# EAGLE design simpluino (EAGLE 5.11)
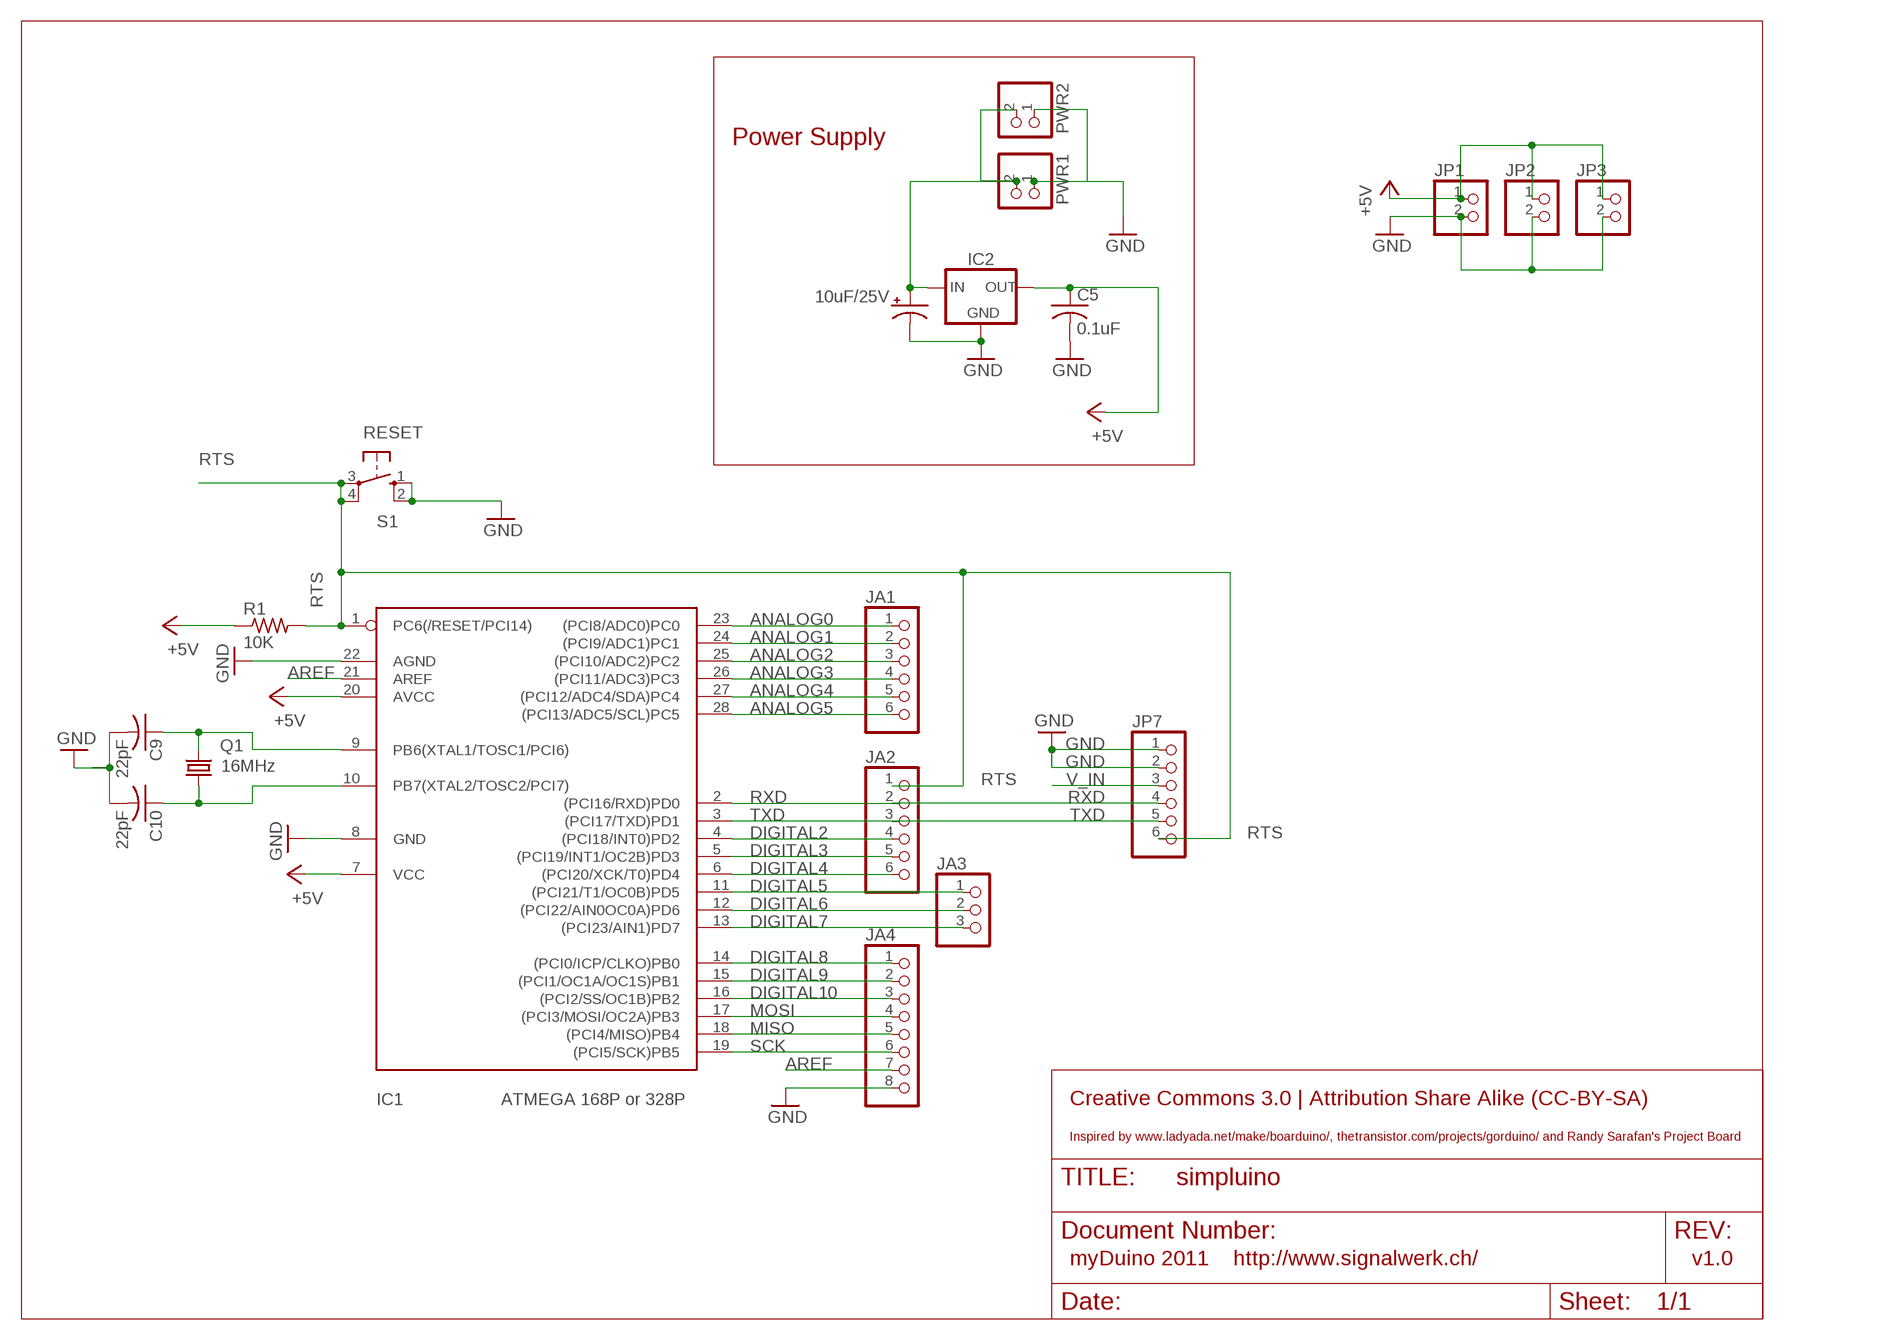
[diagram p0: schematic, sheet 1]

## Parts
C3  10uF/25V  CPOL-USE2.5-6  [E2,5-6]
C5  0.1uF  C-US025-025X050  [C025-025X050]
C9  22pF  C-US025-024X044  [C025-024X044]
C10  22pF  C-US025-024X044  [C025-024X044]
IC1  ATMEGA 168P or 328P  ATMEGA168PROUND  [DIL28/3]
IC2  78XXS  [78XXS]
JA1  PINHD-1X6CB  [1X06-CLEANBIG]
JA2  PINHD-1X6CB  [1X06-CLEANBIG]
JA3  PINHD-1X3CB  [1X03-CB]
JA4  PINHD-1X8CLEANBIG  [1X08-CLEANBIG]
JP1  PINHD-1X2CB  [1X02-CB]
JP2  PINHD-1X2CB  [1X02-CB]
JP3  PINHD-1X2CB  [1X02-CB]
JP7  PINHD-1X6CLEAN  [1X06-CLEAN]
PWR1  PINHD-1X2CB  [1X02-CB]
PWR2  PINHD-1X2CB  [1X02-CB]
Q1  16MHz  CRYTALHC49S  [HC49/S]
R1  10K  R-US_0207/5V  [0207/5V]
S1  RESET  10-XX  [B3F-10XX]

## Nets
+5V: C5.1 IC1.7(VCC) IC1.20(AVCC) IC2.OUT JP1.1 JP2.1 JP3.1 R1.1
ANALOG0: IC1.23((PCI8/ADC0)PC0) JA1.1
ANALOG1: IC1.24((PCI9/ADC1)PC1) JA1.2
ANALOG2: IC1.25((PCI10/ADC2)PC2) JA1.3
ANALOG3: IC1.26((PCI11/ADC3)PC3) JA1.4
ANALOG4: IC1.27((PCI12/ADC4/SDA)PC4) JA1.5
ANALOG5: IC1.28((PCI13/ADC5/SCL)PC5) JA1.6
AREF: IC1.21(AREF) JA4.7
DIGITAL2: IC1.4((PCI18/INT0)PD2) JA2.4
DIGITAL3: IC1.5((PCI19/INT1/OC2B)PD3) JA2.5
DIGITAL4: IC1.6((PCI20/XCK/T0)PD4) JA2.6
DIGITAL5: IC1.11((PCI21/T1/OC0B)PD5) JA3.1
DIGITAL6: IC1.12((PCI22/AIN0OC0A)PD6) JA3.2
DIGITAL7: IC1.13((PCI23/AIN1)PD7) JA3.3
DIGITAL8: IC1.14((PCI0/ICP/CLKO)PB0) JA4.1
DIGITAL9: IC1.15((PCI1/OC1A/OC1S)PB1) JA4.2
DIGITAL10: IC1.16((PCI2/SS/OC1B)PB2) JA4.3
GND: C3.- C5.2 C9.2 C10.2 IC1.8(GND) IC1.22(AGND) IC2.GND JA4.8 JP1.2 JP2.2 JP3.2 JP7.1 JP7.2 PWR1.1 PWR2.1 S1.1(S) S1.2(S1)
MISO: IC1.18((PCI4/MISO)PB4) JA4.5
MOSI: IC1.17((PCI3/MOSI/OC2A)PB3) JA4.4
N$6: C10.1 IC1.10(PB7(XTAL2/TOSC2/PCI7)) Q1.1
N$7: C9.1 IC1.9(PB6(XTAL1/TOSC1/PCI6)) Q1.2
RTS: IC1.1(PC6(/RESET/PCI14)) JA2.1 JP7.6 R1.2 S1.3(P) S1.4(P1)
RXD: IC1.2((PCI16/RXD)PD0) JA2.2 JP7.4
SCK: IC1.19((PCI5/SCK)PB5) JA4.6
TXD: IC1.3((PCI17/TXD)PD1) JA2.3 JP7.5
V_IN: C3.+ IC2.IN JP7.3 PWR1.2 PWR2.2

## Notes on the sheet
- Power Supply
- Creative Commons 3.0 | Attribution Share Alike (CC-BY-SA)
- Inspired by www.ladyada.net/make/boarduino/, thetransistor.com/projects/gorduino/ and Randy Sarafan's Project Board
- myDuino 2011    http://www.signalwerk.ch/ | v1.0

## Library data of the parts
C3 = minimidi:CPOL-US: POLARIZED CAPACITOR, American symbol
C5 = minimidi:C-US: CAPACITOR, American symbol
C9 C10 = resistor:C-US: CAPACITOR, American symbol
IC1 = avr:ATMEGA168*P: MICROCONTROLLER 16 kBytes FLASH 1 kBytes SRAM 512 Bytes EEPROM USART 8-channel 10 bit ADC
IC2 = v-reg:78XXS: VOLTAGE REGULATOR
JA1 JA2 JP7 = carduino:PINHD-1X6: PIN HEADER
JA3 = carduino_sh:PINHD-1X3: PIN HEADER
JA4 = carduino:PINHD-1X8: PIN HEADER
JP1-JP3 PWR1 PWR2 = carduino:PINHD-1X2: PIN HEADER
Q1 = crystal:CRYTAL: CRYSTAL
R1 = rcl-ez:R-US_: RESISTOR, American symbol
S1 = switch-omron:10-XX: OMRON SWITCH

## Net classes
1 power: width 0.61 mm

## Board
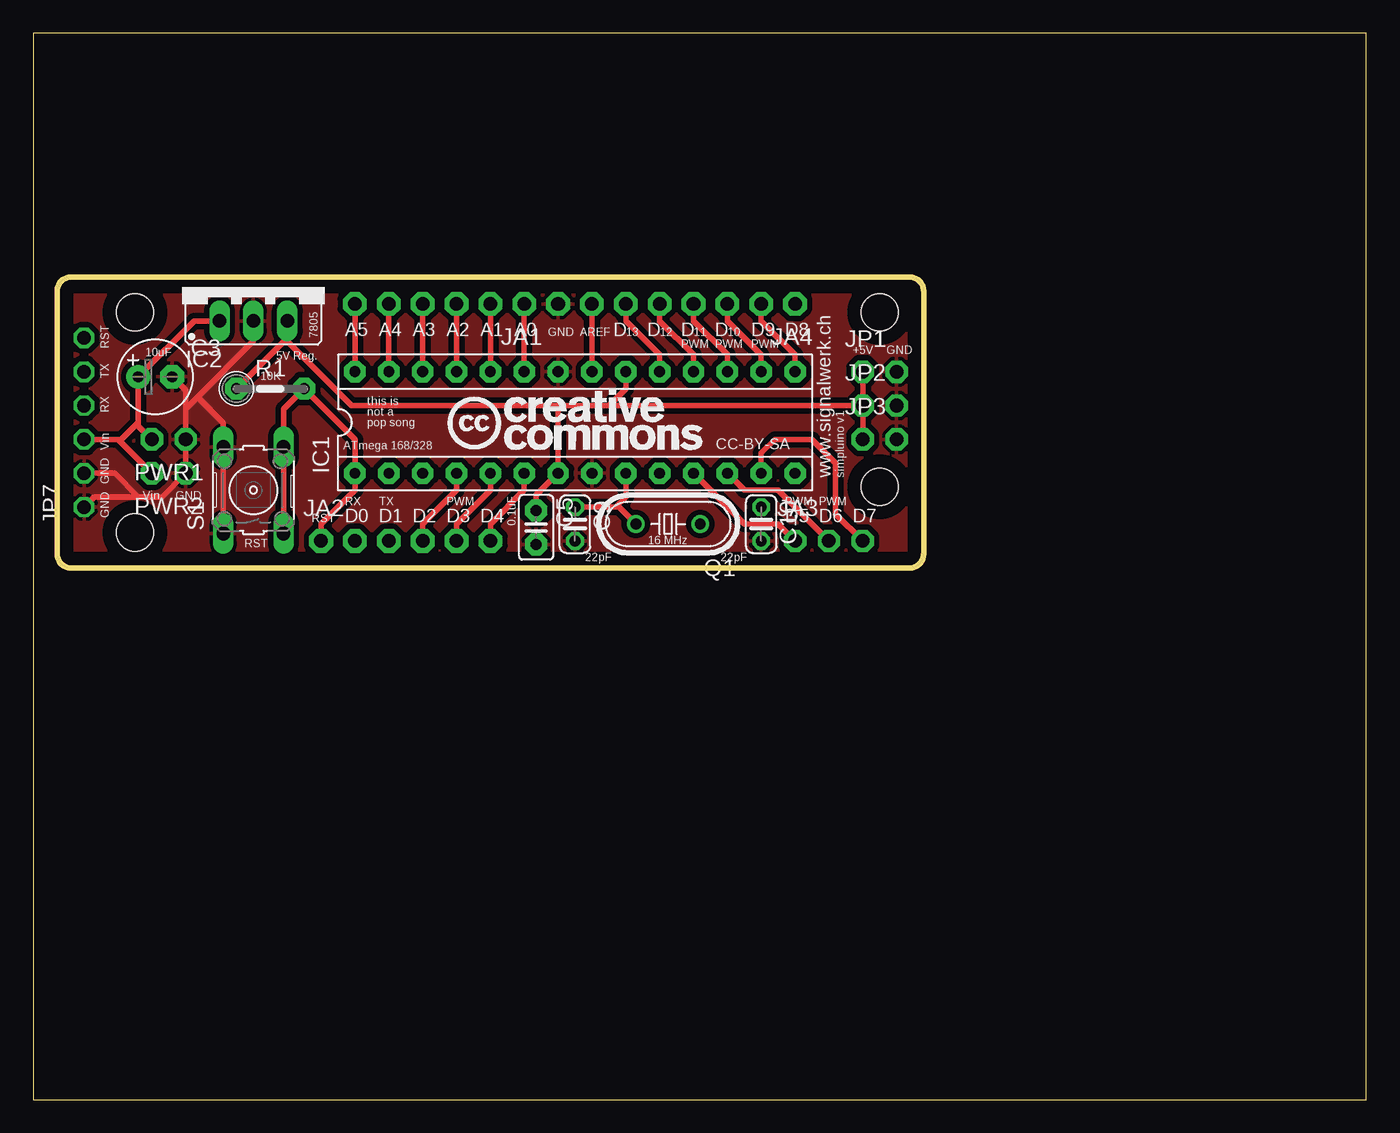
[diagram p1: board, top side]
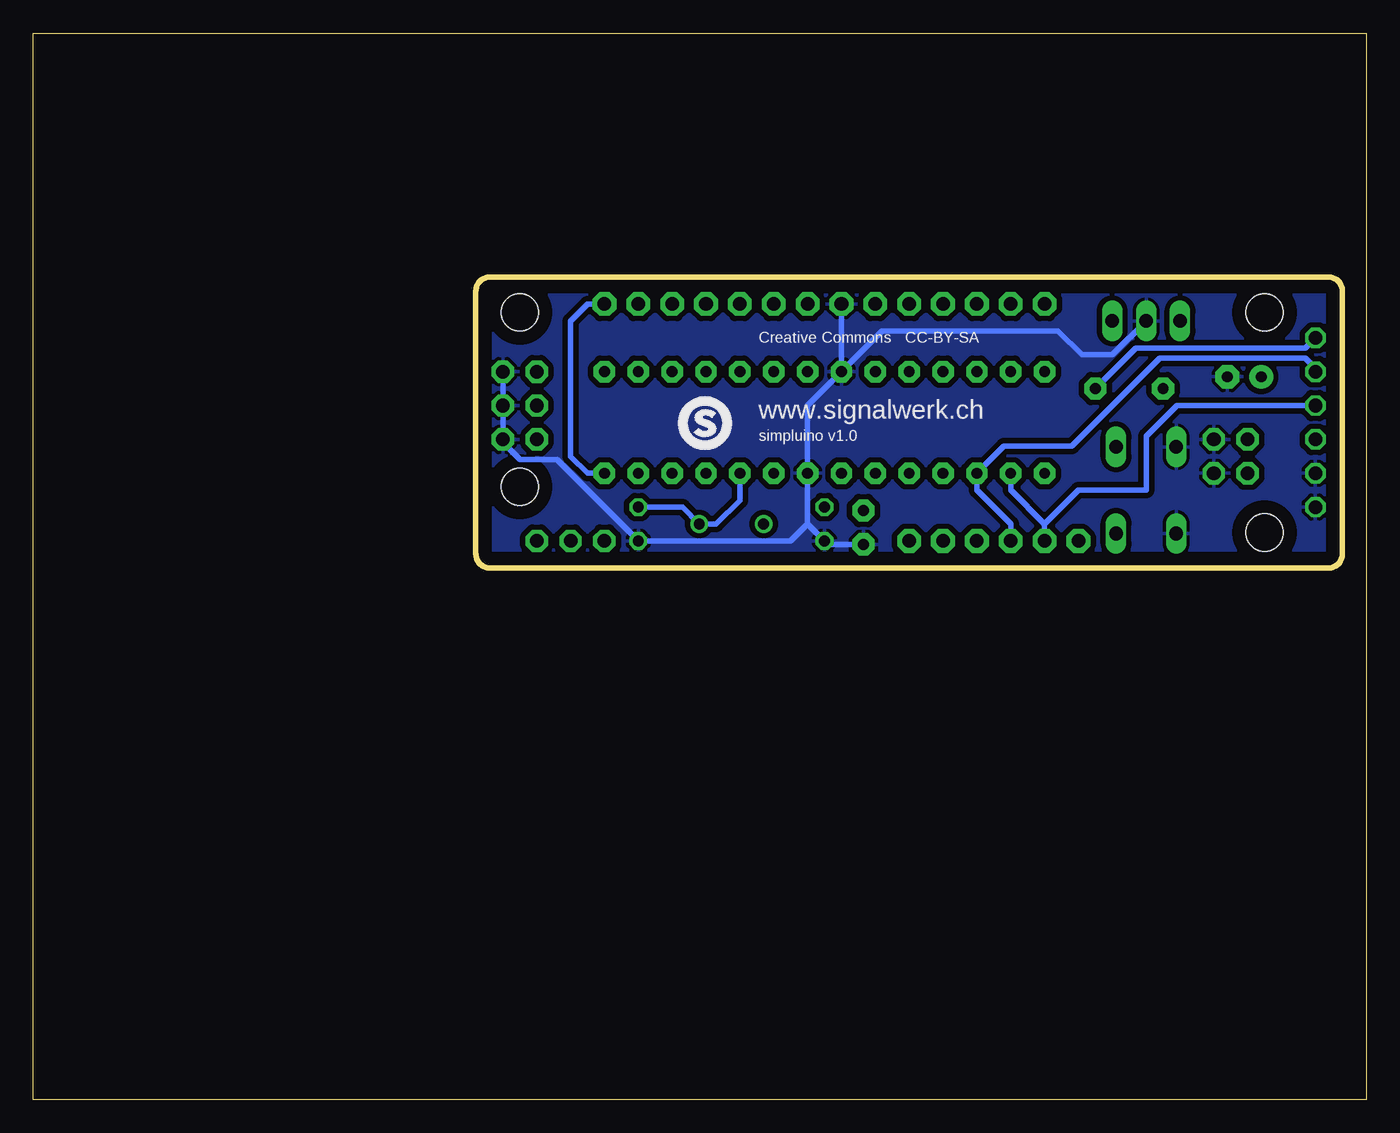
[diagram p2: board, bottom side, seen from below]

Size 100 x 80 mm. Coordinates in mm from the lower left corner, seen from the top.
Outline: 0,0 100,0 100,80 0,80 0,0
Outline: 2.86,61.72 arc90 1.78,60.64 1.78,40.96 arc90 2.86,39.88 65.72,39.88 arc90 66.8,40.96 66.8,60.64 arc90 65.72,61.72 2.86,61.72
Copper layers (1*16): Top 0.035mm / dielectric 1.5mm / Bottom 0.035mm
Design rules "default": minimum track width 10mil, minimum drill 24mil, track to track 8mil, track to pad 8mil, pad to pad 8mil, via to via 8mil, smd to smd 8mil, copper to edge 40mil, drill to drill 8mil, minimum pad ring 10mil, minimum via ring 8mil, stop-mask expansion 4mil, vias tented up to drill 0mil, thermal gap 10mil
Holes 2.8 mm at 7.62,59.05 63.5,45.97 7.62,42.55 63.5,59.05

### Footprints (pad centres in the part's own frame; a part is rotated, then mirrored left to right if it is on the bottom)
E2,5-6 = drill 0.813 pad 1.778 round: + -1.27,0 | drill 0.813 pad 1.778 octagon: - 1.27,0
C025-025X050 = drill 0.813 pad 1.676 octagon: 1 -1.27,0; 2 1.27,0
C025-024X044 = drill 0.813 octagon: 1 -1.27,0; 2 1.27,0
DIL28/3 = drill 0.813 pad 1.6 octagon: 1 -16.51,-3.81; 2 -13.97,-3.81; 3 -11.43,-3.81; 4 -8.89,-3.81; 5 -6.35,-3.81; 6 -3.81,-3.81; 7 -1.27,-3.81; 8 1.27,-3.81; 9 3.81,-3.81; 10 6.35,-3.81; 11 8.89,-3.81; 12 11.43,-3.81; 13 13.97,-3.81; 14 16.51,-3.81; 15 16.51,3.81; 16 13.97,3.81; 17 11.43,3.81; 18 8.89,3.81; 19 6.35,3.81; 20 3.81,3.81; 21 1.27,3.81; 22 -1.27,3.81; 23 -3.81,3.81; 24 -6.35,3.81; 25 -8.89,3.81; 26 -11.43,3.81; 27 -13.97,3.81; 28 -16.51,3.81
78XXS = drill 1.016 long: GND 0,-2.54; IN -2.54,-2.54; OUT 2.54,-2.54
1X06-CLEANBIG = drill 1.016 pad 1.778 octagon: 1 -6.35,0; 2 -3.81,0; 3 -1.27,0; 4 1.27,0; 5 3.81,0; 6 6.35,0
1X03-CB = drill 1.016 pad 1.676 octagon: 1 -3.81,0; 2 -1.27,0; 3 1.27,0
1X08-CLEANBIG = drill 1.016 pad 1.778 octagon: 1 -8.89,0; 2 -6.35,0; 3 -3.81,0; 4 -1.27,0; 5 1.27,0; 6 3.81,0; 7 6.35,0; 8 8.89,0
1X02-CB = drill 1.016 pad 1.676 octagon: 1 -1.27,0; 2 1.27,0
1X06-CLEAN = drill 1.016 octagon: 1 -6.35,0; 2 -3.81,0; 3 -1.27,0; 4 1.27,0; 5 3.81,0; 6 6.35,0
HC49/S = drill 0.813 round: 1 -2.413,0; 2 2.413,0
0207/5V = drill 0.813 pad 1.676 octagon: 1 -2.54,0; 2 2.54,0
B3F-10XX = drill 1.016 long: 1 -3.251,2.261; 2 3.251,2.261; 3 -3.251,-2.261; 4 3.251,-2.261

### Placement (x,y rotation side)
C3  9.14,54.23 0 top
C5  37.72,42.93 270 top
C9  40.64,43.18 270 top
C10  54.61,43.18 270 top
IC1  40.64,50.8 0 top
IC2  16.51,60.96 0 top
JA1  30.48,59.69 180 top
JA2  27.94,41.91 0 top
JA3  60.96,41.91 0 top
JA4  48.26,59.69 180 top
JP1  63.5,54.61 0 top
JP2  63.5,52.07 0 top
JP3  63.5,49.53 0 top
JP7  3.81,50.8 90 top
PWR1  10.16,49.53 180 top
PWR2  10.16,46.99 180 top
Q1  47.62,43.18 180 top
R1  17.78,53.34 0 top
S1  16.51,45.72 90 top

### Tracks (layer width: path | path; a pad name or v marks a point on that pad's centre or on a via)
+5V
  Top 0.406: C5.1 37.72,45.34 IC1.7 39.37,52.07 | R1.1 19.05,57.15 | 19.05,57.15 IC2.OUT | 19.05,57.15 19.05,56.9 23.88,52.07 39.37,52.07 | 39.37,52.07 43.18,52.07 | 43.18,52.07 JP2.1 | IC1.20 44.45,53.34 43.18,52.07 | JP2.1 JP3.1 | JP2.1 JP1.1
ANALOG0
  Top 0.406: IC1.23 JA1.1
ANALOG1
  Top 0.406: IC1.24 JA1.2
ANALOG2
  Top 0.406: IC1.25 JA1.3
ANALOG3
  Top 0.406: IC1.26 JA1.4
ANALOG4
  Top 0.406: IC1.27 JA1.5
ANALOG5
  Top 0.406: IC1.28 JA1.6
AREF
  Top 0.406: IC1.21 JA4.7
DIGITAL2
  Top 0.406: IC1.4 31.75,45.72 29.21,43.18 JA2.4
DIGITAL3
  Top 0.406: IC1.5 34.29,45.72 31.75,43.18 JA2.5
DIGITAL4
  Top 0.406: IC1.6 36.83,45.72 34.29,43.18 JA2.6
DIGITAL5
  Top 0.406: IC1.11 53.34,43.18 55.88,43.18 JA3.1
DIGITAL6
  Top 0.406: IC1.12 53.34,45.72 55.88,45.72 JA3.2
DIGITAL7
  Top 0.406: JA3.3 60.2,43.94 60.2,47.75 58.42,49.53 55.63,49.53 54.61,48.51 IC1.13
DIGITAL8
  Bottom 0.406: IC1.14 58.42,46.99 59.69,48.26 59.69,58.42 58.42,59.69 JA4.1
DIGITAL9
  Top 0.406: IC1.15 57.15,55.88 54.61,58.42 JA4.2
DIGITAL10
  Top 0.406: IC1.16 54.61,55.88 52.07,58.42 JA4.3
GND
  Top 0.406: S1.1 S1.2 14.25,50.77 12.32,52.7 | JP7.1 4.57,45.21 7.87,45.21 | 7.87,45.21 9.65,45.21 PWR2.1 PWR1.1 11.43,51.82 | JP7.2 6.1,46.99 7.87,45.21 | 11.43,51.82 12.32,52.7 | 12.32,52.7 16.51,56.9 IC2.GND | 11.43,51.82 11.43,53.21 C3.-
  Bottom 0.406: 41.91,43.18 IC1.8 41.91,52.07 IC1.22 | 41.91,43.18 C9.2 40.39,41.66 C5.2 | 41.91,43.18 43.18,41.91 C10.2 60.71,48.01 63.5,48.01 64.77,49.28 JP3.2 JP2.2 JP1.2 | IC2.GND 19.05,55.88 21.34,55.88 23.11,57.66 36.32,57.66 IC1.22 | IC1.22 JA4.8
  pour Bottom (isolate 0.406): 1.78,61.72 66.8,61.72 66.8,39.88 1.78,39.88
  pour Top (isolate 0.406): 1.78,61.72 66.8,61.72 66.8,39.88 1.78,39.88
MISO
  Top 0.406: IC1.18 49.53,55.88 46.99,58.42 JA4.5
MOSI
  Top 0.406: IC1.17 52.07,55.88 49.53,58.42 JA4.4
N$6
  Bottom 0.406: C10.1 51.31,44.45 Q1.1 48.77,43.18 46.99,44.96 IC1.10
N$7
  Top 0.406: C9.1 43.69,44.45 | 43.69,44.45 43.94,44.45 Q1.2 | IC1.9 44.45,45.21 43.69,44.45
RTS
  Top 0.406: JA2.1 21.59,43.18 24.13,45.72 IC1.1 24.13,49.53 R1.2 18.77,51.79 S1.4 S1.3
  Bottom 0.406: JP7.6 4.57,56.39 17.27,56.39 R1.2
RXD
  Bottom 0.406: JP7.4 14.22,52.07 16.51,49.78 16.51,45.72 21.59,45.72 24.13,43.18 | IC1.2 26.67,45.72 24.13,43.18 | 24.13,43.18 JA2.2
SCK
  Top 0.406: IC1.19 46.99,55.88 44.45,58.42 JA4.6
TXD
  Bottom 0.406: JA2.3 26.67,43.18 29.21,45.72 IC1.3 27.18,49.02 22.1,49.02 15.49,55.63 4.57,55.63 3.81,54.86 JP7.5
V_IN
  Top 0.406: IC2.IN 12.06,58.42 C3.+ 7.87,50.8 | JP7.3 6.35,49.53 | 6.35,49.53 PWR2.2 | 7.87,50.8 7.87,50.55 PWR1.2 | 6.35,49.53 6.6,49.53 7.87,50.8

### Text on the board
tPlace: 7805 | A5 | A4 | A3 | A2 | A1 | A0 | GND | AREF | D | 13 | D | 12 | D | 11 | D | 10 | D9 | D8 | RST | 10uF | 5V Reg. | PWM | PWM | PWM | +5V | GND | TX | 10K | RX | this is | not a | pop song | Vin | ATmega 168/328 | CC-BY-SA | www.signalwerk.ch | simpluino v1 | GND | Vin | GND | RX | TX | PWM | PWM | PWM | GND | RST | D0 | D1 | D2 | D3 | D4 | 0.1uF | D5 | D6 | D7 | 16 MHz | RST | 22pF | 22pF
bPlace: Creative Commons CC-BY-SA | www.signalwerk.ch | simpluino v1.0